# Altium schematic sheet Textron PCB Project.SchDoc
size A4; SheetNumber: 1; SheetTotal: 1
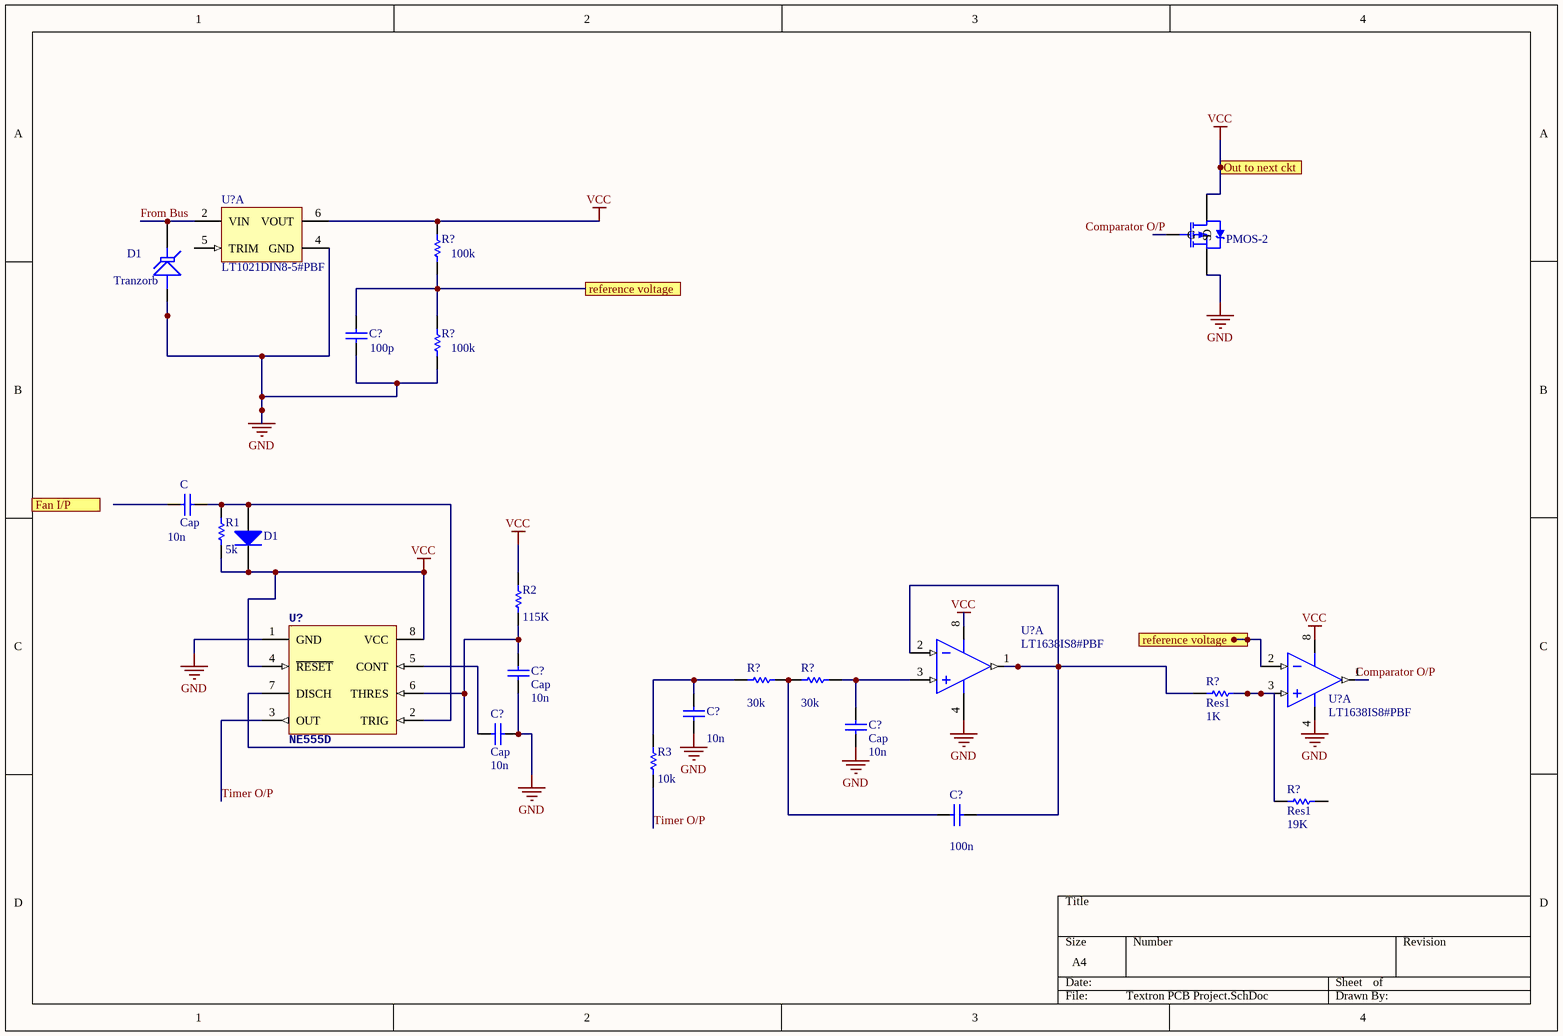
[diagram p0: Textron PCB Project.SchDoc]

## Parts
(Parts that share a designator on the sheet are numbered #1, #2 ... from top to bottom, then left to right.)
C  Cap  Cap1: 10n  [RAD-0.3]
C?#1  value 100p  [RAD-0.3]  (hidden comment: Cap)
C?#2  Cap  value 10n  [RAD-0.3]
C?#3  Cap  value 10n  [RAD-0.3]
C?#4  value 10n  [RAD-0.3]  (hidden comment: Cap)
C?#5  Cap  value 10n  [RAD-0.3]
C?#6  value 100n  [RAD-0.3]  (hidden comment: Cap)
D1#1  Tranzorb  [DO-7]
D1#2  Diode  [SMC]  (value not drawn)
Q?  PMOS-2  [TO-220AB]
R1  Res1  [AXIAL-0.3]  (value not drawn)
R2  value 115K  [AXIAL-0.3]  (hidden comment: Res1)
R3  value 10k  [AXIAL-0.3]
R?#1  value 100k  [AXIAL-0.3]  (hidden comment: Res1)
R?#2  value 100k  [AXIAL-0.3]  (hidden comment: Res1)
R?#3  Res1  value 1K  [AXIAL-0.3]
R?#4  value 30k  [AXIAL-0.3]  (hidden comment: Res1)
R?#5  value 30k  [AXIAL-0.3]  (hidden comment: Res1)
R?#6  Res1  value 19K  [AXIAL-0.3]
U?#1  LT1021DIN8-5#PBF  [LT-N8-8]  (part A of 2)
U?#2  LT1638IS8#PBF  [LT-S8-8_N]  (part A of 2)
U?#3  LT1638IS8#PBF  [LT-S8-8_N]  (part A of 2)
U?#4  NE555D  [D0008A_L]

## Ports
Fan I/P, Out to next ckt (out), reference voltage

## Nets
GND: C?#1.1 C?#2.1 C?#3.2 C?#4.1 C?#5.1 D1#1.1(A) Q?.3(S) R?#2.2 U?#1.4(GND) U?#2.4(V-) U?#4.1(GND)
VCC: D1#2.2(K) Q?.2(D) R1.1 R2.2 R?#1.1 U?#1.6(VOUT) U?#2.8(V+) U?#4.4(~{RESET}) U?#4.8(VCC) ; port Out to next ckt
Comparator O/P: U?#3.1(OUT_A)
From Bus: D1#1.2(K) U?#1.2(VIN)
reference voltage: C?#1.2 R?#1.2 R?#2.1 U?#3.2(-IN_A) ; port reference voltage
Timer O/P: R3.1 U?#4.3(OUT)
NetC?#2_2: C?#2.2 R2.1 U?#4.6(THRES) U?#4.7(DISCH)
NetC?#3_1: C?#3.1 U?#4.5(CONT)
NetC?#4_2: C?#4.2 R3.2 R?#4.2
NetC?#5_2: C?#5.2 R?#5.1 U?#2.3(+IN_A)
NetC?#6_1: C?#6.1 R?#3.1 U?#2.1(OUT_A) U?#2.2(-IN_A)
NetC?#6_2: C?#6.2 R?#4.1 R?#5.2
NetC_2: C.2 D1#2.1(A) R1.2 U?#4.2(TRIG)
NetR?#3_2: R?#3.2 R?#6.1 U?#3.3(+IN_A)

Not connected (* = marked no-connect by the designer): C 1; Q? 1(G); R?#6 2; U?#1 5(TRIM); U?#3 4(V-) 8(V+)

## Notes on the sheet
- Labels drawn without touching a wire or pin: Comparator O/P, GND, VCC
- (in symbol Res1) 5k

## Library data of the parts
C C?#1-C?#6 = Cap: Capacitor; Published: 8-Jun-2000; LatestRevisionDate: 17-Jul-2002; LatestRevisionNote: Re-released for DXP Platform.; PackageReference: RAD-0.3; Publisher: Altium Limited; PackageDescription: Radial Cap, Thru-Hole; 2 Leads; 0.3 in Pin Spacing
D1#1 = Tranzorb: Diode TVS Single Uni-Dir 7.78V 1.5KW 2-Pin SMC T/R; Manufacturer: Littelfuse; Manufacturer Part Number: 1.5SMC9.1A; Min Breakdown Voltage: 8.65V; Clamping Voltage: 125V; Peak Pulse Current: 113.4A; Operating Supply Voltage: 77.8V; Max Surge Current: 12.2A; Number of Unidirectional Channels: 1; Power Line Protection: No; Breakdown Voltage: 86.5V; Polarity: Unidirectional; Diode Type: ZENER; Leakage Current: 1uA; Test Current: 1mA; Voltage Rating (DC): 9.1V; Published: 24-Mar-1999; LatestRevisionDate: 17-Jul-2002; LatestRevisionNote: Re-released for DXP Platform.; PackageReference: DO-7; Publisher: Altium Limited; PackageDescription: Axial Lead Diode; Supplier 1: Mouser; RoHS: Yes; Category: TVS Diodes; Stock 1: 703; Pricing 1: 1=0.66000, 10=0.58800, 50=0.58800, 100=0.45100, 500=0.35700, 1000=0.28000, 3000=0.25300, 6000=0.23500, 9000=0.22700, 10000=0.22700, 24000=0.21800 (USD); Mount: Surface Mount; Case/Package: DO-214AB; Number of Pins: 2; Min Operating Temperature: -55°C; Max Operating Temperature: 150°C; Packaging: Tape and Reel; Reverse Standoff Voltage: 7.78V; Peak Pulse Power: 1.5kW; Package Quantity: 3000; Number of Channels: 1; Resistor Type: Zener; Series: 1.5SMC; Termination: SMD/SMT; Number of Elements: 1; Reverse Breakdown Voltage: 86.5V; Length: 8.13mm; Width: 6.22mm; Height: 2.62mm; RoHS Compliant: Yes; Lead Free: Lead Free; ComponentLink1URL: https://datasheet.ciiva.com/348/littelfuse-tvs-diode-1-5smc-datasheet-pdf-348432.pdf?src-supplier=Digi-Key; ComponentLink1Description: https://datasheet.ciiva.com/348/littelfuse-tvs-diode-1-5smc-datasheet-pdf-348432.pdf?src-supplier=Digi-Key; ComponentLink2URL: https://datasheet.ciiva.com/348/littelfuse-tvs-diode-1-5smc-datasheet-pdf-348446.pdf?src-supplier=Digi-Key; ComponentLink2Description: https://datasheet.ciiva.com/348/littelfuse-tvs-diode-1-5smc-datasheet-pdf-348446.pdf?src-supplier=Digi-Key
D1#2 = Diode: Default Diode; Published: 8-Jun-2000; LatestRevisionDate: 17-Jul-2002; LatestRevisionNote: Re-released for DXP Platform.; PackageVersion: Sep-1996; PackageReference: SMC; Publisher: Altium Limited; PackageDescription: DO-214-AB/SMC; 2 C-Bend Leads; Body 7.9 x 5.9 mm, inc. leads (LxW); Code_JEDEC: DO-214-AB
Q? = PMOS-2: P-Channel Power MOSFET; Note: Pin 4 not drawn and electrically connected to Pin 2.; Published: 8-Jun-2000; LatestRevisionDate: 17-Jul-2002; LatestRevisionNote: Re-released for DXP Platform.; DatasheetVersion: PD-9.390D; PackageVersion: Feb-1997; PackageReference: TO-220AB; Publisher: Altium Limited; PackageDescription: TO, Thru-Hole, Vertical, Heatsink Mounted; 3 In-Line Leads; Pitch 2.54 mm; ComponentLink1Description: Manufacturer Link; ComponentLink1URL: http://www.irf.com/
R1-R3 R?#3-R?#6 = Res1: Resistor; Published: 8-Jun-2000; LatestRevisionDate: 17-Jul-2002; LatestRevisionNote: Re-released for DXP Platform.; PackageReference: AXIAL-0.3; Publisher: Altium Limited; PackageDescription: Axial Device, Thru-Hole; 2 Leads; 0.3 in Pin Spacing
R?#1 = Res1: Manufacturer: Vishay Dale; Manufacturer Part Number: RLR20C5001GRB14; Resistance: 5kR; Tolerance: 2%; Temperature Coefficient: 100ppm/°C; Published: 8-Jun-2000; LatestRevisionDate: 17-Jul-2002; LatestRevisionNote: Re-released for DXP Platform.; PackageReference: AXIAL-0.3; Publisher: Altium Limited; PackageDescription: Axial Device, Thru-Hole; 2 Leads; 0.3 in Pin Spacing; Supplier 1: DigiKey; RoHS: No; Category: Through-Hole Resistors; Pricing 1: 1000=1.81573 (USD); Mount: Through Hole; Case/Package: Conformal; Contact Plating: Tin,Lead; Min Operating Temperature: -65°C; Max Operating Temperature: 150°C; Resistor Type: Metal Film; Diameter: 3.51mm; Length: 11.43mm; Width: 3.51mm; Military Standard: MIL-PRF-39017; Lead Free: Contains Lead; RoHS Compliant: No; ComponentLink1URL: http://www.vishay.com/docs/31023/erl.pdf?src-supplier=Avnet; ComponentLink1Description: http://www.vishay.com/docs/31023/erl.pdf?src-supplier=Avnet
R?#2 = Res1: Res Metal Film 5K Ohm 2% 1/2W ±100ppm/°C 0.01% Conformal AXL Thru-Hole Bulk; Manufacturer: Vishay Dale; Manufacturer Part Number: RLR20C5001GRB14; Resistance: 5kR; Published: 8-Jun-2000; LatestRevisionDate: 17-Jul-2002; LatestRevisionNote: Re-released for DXP Platform.; PackageReference: AXIAL-0.3; Publisher: Altium Limited; PackageDescription: Axial Device, Thru-Hole; 2 Leads; 0.3 in Pin Spacing; Supplier 1: DigiKey; RoHS: No; Category: Through-Hole Resistors; Pricing 1: 1000=1.81573 (USD); Mount: Through Hole; Case/Package: Conformal; Contact Plating: Tin,Lead; Min Operating Temperature: -65°C; Max Operating Temperature: 150°C; Tolerance: 2%; Resistor Type: Metal Film; Temperature Coefficient: 100ppm/°C; Diameter: 3.51mm; Length: 11.43mm; Width: 3.51mm; Military Standard: MIL-PRF-39017; Lead Free: Contains Lead; RoHS Compliant: No; ComponentLink1URL: http://www.vishay.com/docs/31023/erl.pdf?src-supplier=Avnet; ComponentLink1Description: http://www.vishay.com/docs/31023/erl.pdf?src-supplier=Avnet
U?#1 = CMP-1638-00014-1: Precision Reference, 5 V, -40 to 85 degC, 8-Pin DIP (N8), RoHS, Rail/Tube; Generic Part Number: LT1021; Tolerance: 0.05%; VOUT: 5 V; ComponentLink1Description: Manufacturer URL; ComponentLink3Description: Package Specification; Temperature Min: -40 degC; PackageDescription: 8-Pin PDIP, Body 10.16 x 6.48 mm, Pitch 2.54 mm; PackageVersion: Rev. I, 07/2011; ComponentLink2URL: http://cds.linear.com/docs/en/datasheet/1021fc.pdf; Mounting Technology: Through Hole; RoHS: TRUE; PartNumber: LT1021DIN8-5#PBF; ComponentLink1URL: http://www.linear.com/; Temperature Max: 85 degC; DatasheetVersion: Rev. C; Packing: Rail/Tube; ComponentLink3URL: http://www.linear.com/docs/en/packaging/05081510_I_N8.pdf; ComponentLink2Description: Datasheet
U?#2 U?#3 = CMP-0359-03568-2: Dual Channel, High Voltage, Micropower Rail-to-Rail Operational Amplifier, 1.2 MHz Typical GBW, 0.38 V/us Typical SR, 2.2 to 44 V, 8-Pin SOIC (S8-8), Industrial, Pb-Free; Linear Technology Part Number: LT1638; Manufacturer: Linear Technology; SR (V/us) Typical: 0.38; GBW (MHz) Typical: 1.2; Vs Min (V): 2.2; Vs Max (V): 44; Is (mA) Typical: 0.17; Channels (#): 2; Vos (mV) Guaranteed: 0.6; Vos (mV) Typical: 0.2; RoHS: Pb-Free; ComponentLink1Description: Manufacturer URL; ComponentLink3URL: http://cds.linear.com/docs/en/packaging/05081610_G_SO8.pdf; PackageReference: LT-S8-8; ComponentLink2Description: Datasheet; ComponentLink3Description: Package Specification; ComponentLink2URL: http://cds.linear.com/docs/en/datasheet/16389fg.pdf; ComponentLink1URL: http://www.linear.com/; RevisionNote: URLs updated; Type: VFB; Mounting Technology: Surface Mount; PackageVersion: Rev G; PartNumber: LT1638IS8#PBF; PackageDescription: 8-Pin Plastic Small Outline, Body 4.9 x 3.9 mm, Pitch 1.27 mm; DatasheetVersion: Rev. G
U?#4 = CMP-2000-06840-1: Precision Timer, 4.5 to 16 V, 0 to 70 degC, 8-Pin SOIC (D), Green (RoHS & no Sb/Br), Tube; PartNumber: NE555; Manufacturer: Texas Instruments; Base Number: 555; No. of Timers: 1; Supply Voltage Min: 4.5V; Operating Frequency Max: 0.5MHz; Supply Voltage Range: 4.5Vto16V; No. of Pins: 8; Supply Voltage Max: 16V; IC Temperature Range: Commercial; SVHC: NoSVHC(19-Dec-2012); Operating Mode: Astable,Monostable; Frequency: 500kHz; Package Description: 8-Pin Small Outline Integrated Circuit, Body 4.9 x 3.9 mm, Pitch 1.27 mm; Datasheet URL: http://www.ti.com/general/docs/lit/getliterature.tsp?genericPartNumber=NE555&fileType=pdf; Mounting Technology: SurfaceMount; Operating Temperature Range: 0°Cto+70°C; Operating Temperature Min: 0°C; Package URL: http://www.ti.com/lit/ml/msoi002j/msoi002j.pdf; Datasheet Version: Rev. I, 09/2014; Manufacturer URL: http://www.ti.com/; Digital IC Case Style: SOIC; Clock External Input: No; Logic Function Number: 555; IC Generic Number: 555; No. of Channels: 1; Operating Temperature Max: 70°C; Package / Case: SOIC; Package Reference: D8; Device Marking: NE555D